# EAGLE design working (EAGLE 9.0.0)
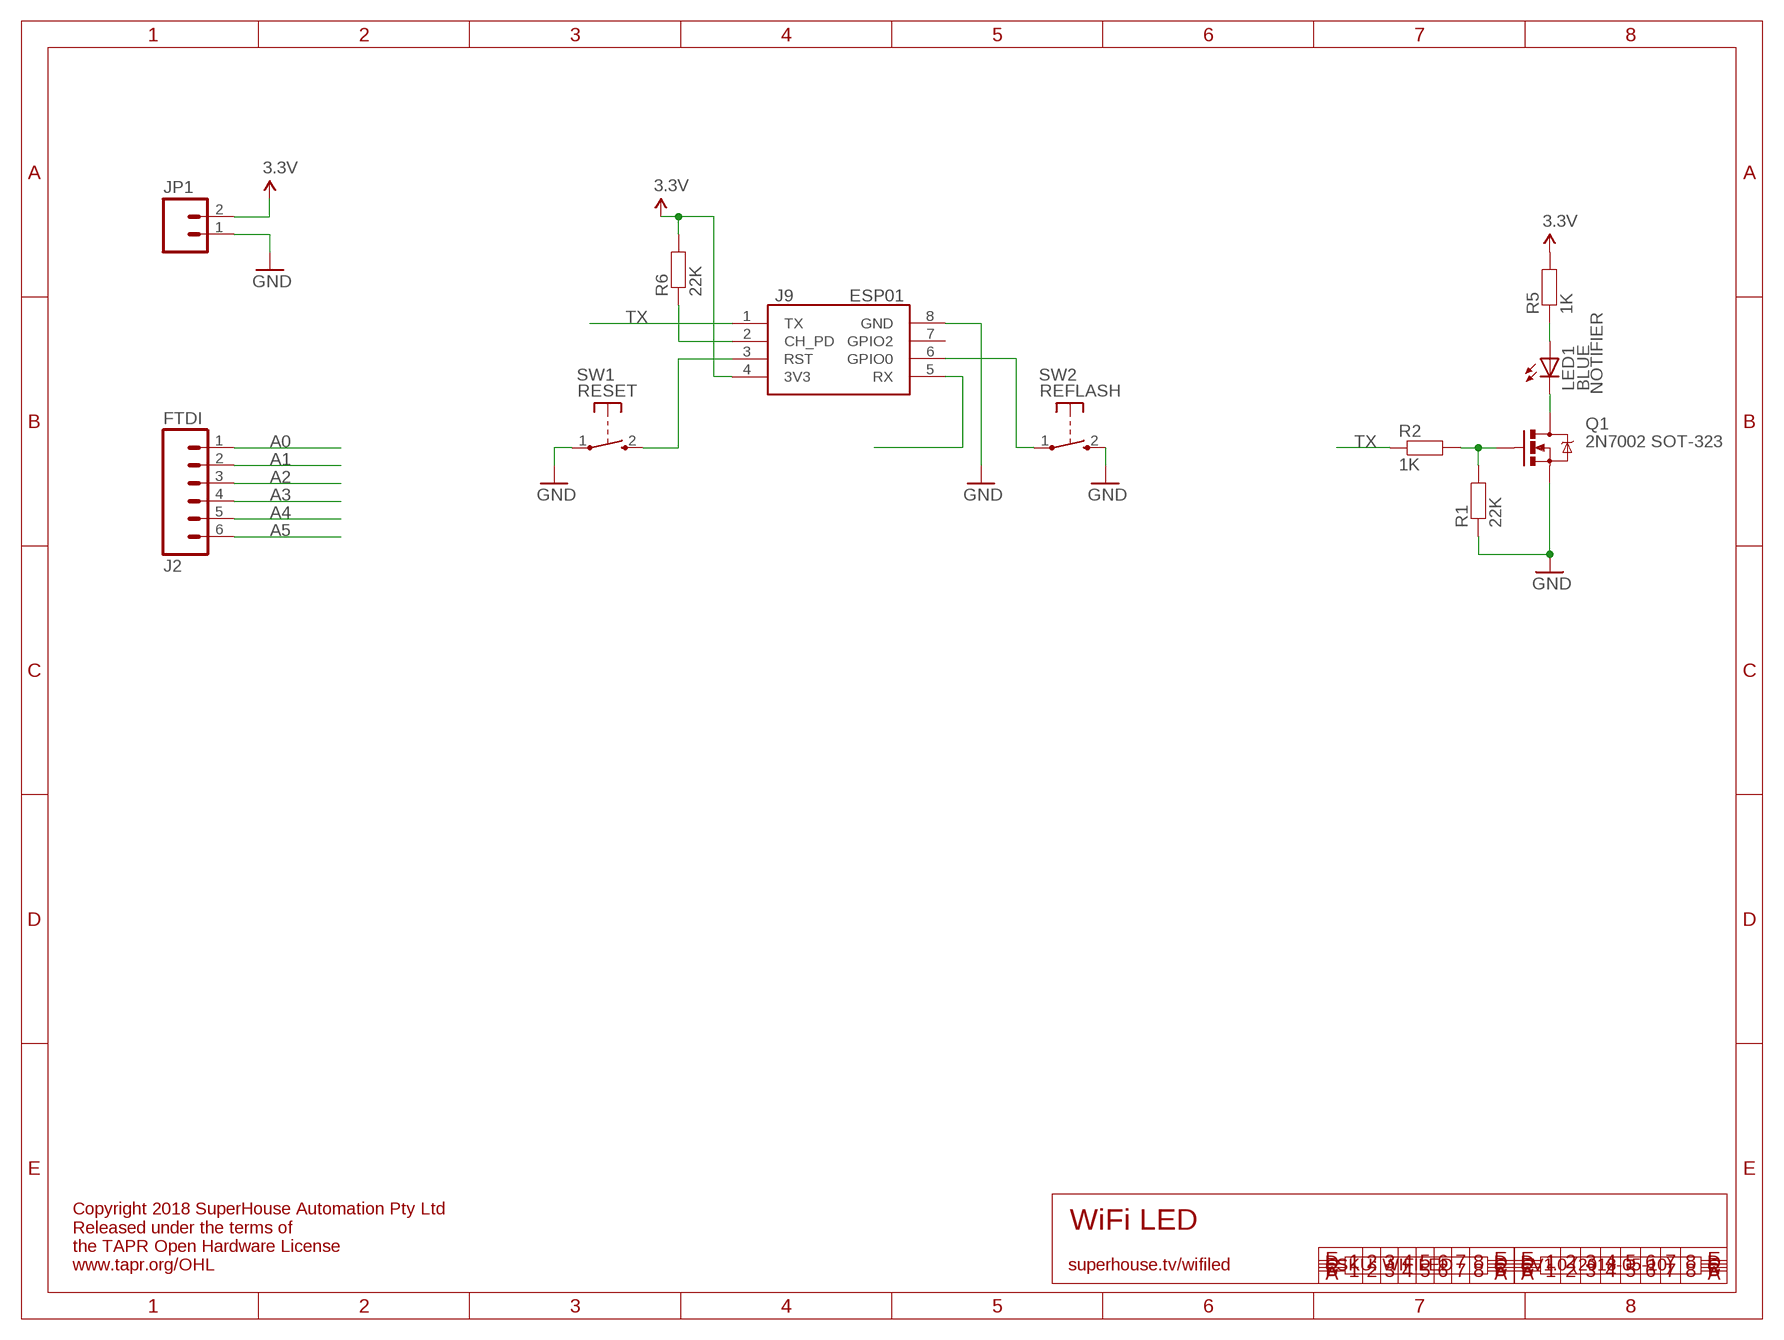
[diagram p0: schematic, sheet 1]

## Parts
J2  FTDI  M06SIP  [1X06]
J9  ESP01  [ESP01]
JP1  M02PTH  [1X02]
LED1  BLUE  LED0603  [LED-0603]
Q1  2N7002 SOT-323  MOSFET-NSOT-323  [SOT32-3]
R1  22K  RESISTOR0603  [0603]
R2  1K  RESISTOR0603  [0603]
R5  1K  RESISTOR0603  [0603]
R6  22K  RESISTOR0603  [0603]
SW1  RESET  TAC_SWITCH_2PIN  [TACTILE_SWITCH_SMD_2PIN_TINY]
SW2  REFLASH  TAC_SWITCH_2PIN  [TACTILE_SWITCH_SMD_2PIN_TINY]

## Nets
3.3V: J9.4(3V3) JP1.2 R5.2 R6.2
A0: J2.1
A1: J2.2
A2: J2.3
A3: J2.4
A4: J2.5
A5: J2.6
GND: J9.8(GND) JP1.1 Q1.2(S) R1.1 SW1.1(P) SW2.2(S)
N$1: J9.6(GPIO0) SW2.1(P)
N$2: LED1.C Q1.3(D)
N$3: J9.3(RST) SW1.2(S)
N$4: J9.2(CH_PD) R6.1
N$14: LED1.A R5.1
N$45: J9.5(RX)
N$58: Q1.1(G) R1.2 R2.2
TX: J9.1(TX) R2.1
Unconnected: J9.7(GPIO2)

## Notes on the sheet
- NOTIFIER
- WiFi LED
- Copyright 2018 SuperHouse Automation Pty Ltd
  Released under the terms of
  the TAPR Open Hardware License
  www.tapr.org/OHL
- superhouse.tv/wifiled | SKU: WIFILED | V1.0 (2018-05-10)

## Library data of the parts
J2 = freetronics:M06: Header 6 Standard 6-pin 0.1" header. Use with straight break away headers (SKU : PRT-00116), right angle break away headers (PRT-00553), swiss pins (PRT-00743), machine pins (PRT-00117), and female headers (PRT-00115). Molex polarized connector foot print use with SKU : PRT-08094 with associated crimp pins and housings. NOTES ON THE VARIANTS LOCK and LOCK_LONGPADS... This footprint was designed to help hold the alignment of a through-hole component (i.e. 6-pin header) while soldering it into place. You may notice that each hole has been shifted either up or down by 0.005 of an inch from it's more standard position (which is a perfectly straight line). This slight alteration caused the pins (the squares in the middle) to touch the edges of the holes. Because they are alternating, it causes a "brace" to hold the component in place. 0.005 has proven to be the perfect amount of "off-center" position when using our standard breakaway headers. Although looks a little odd when you look at the bare footprint, once you have a header in there, the alteration is very hard to notice. Also, if you push a header all the way into place, it is covered up entirely on the bottom side. This idea of altering the position of holes to aid alignment will be further integrated into the Sparkfun Library for other footprints. It can help hold any component with 3 or more connection pins.
J9 = freetronics-jon:ESP01
JP1 = freetronics-jon:M02: Header 2 Standard 2-pin 0.1" header. Use with straight break away headers (SKU : PRT-00116), right angle break away headers (PRT-00553), swiss pins (PRT-00743), machine pins (PRT-00117), and female headers (PRT-00115). Molex polarized connector foot print use with SKU : PRT-08233 with associated crimp pins and housings.
LED1 = freetronics-jon:LED: LEDs Standard schematic elements and footprints for 5mm, 3mm, 1206, and 0603 sized LEDs. 5mm - Spark Fun Electronics SKU : COM-00529 (and others)
Q1 = freetronics-jon:MOSFET-N: Basic N-Channel MOSFET
R1 R2 R5 R6 = freetronics-jon:RESISTOR: Resistor Basic schematic elements and footprints for 0603, 1206, and PTH 1/10th watt (small) resistors.
SW1 SW2 = freetronics-jon:TAC_SWITCH_2PIN: Momentary Tactile Switch - 2 pin

## Board
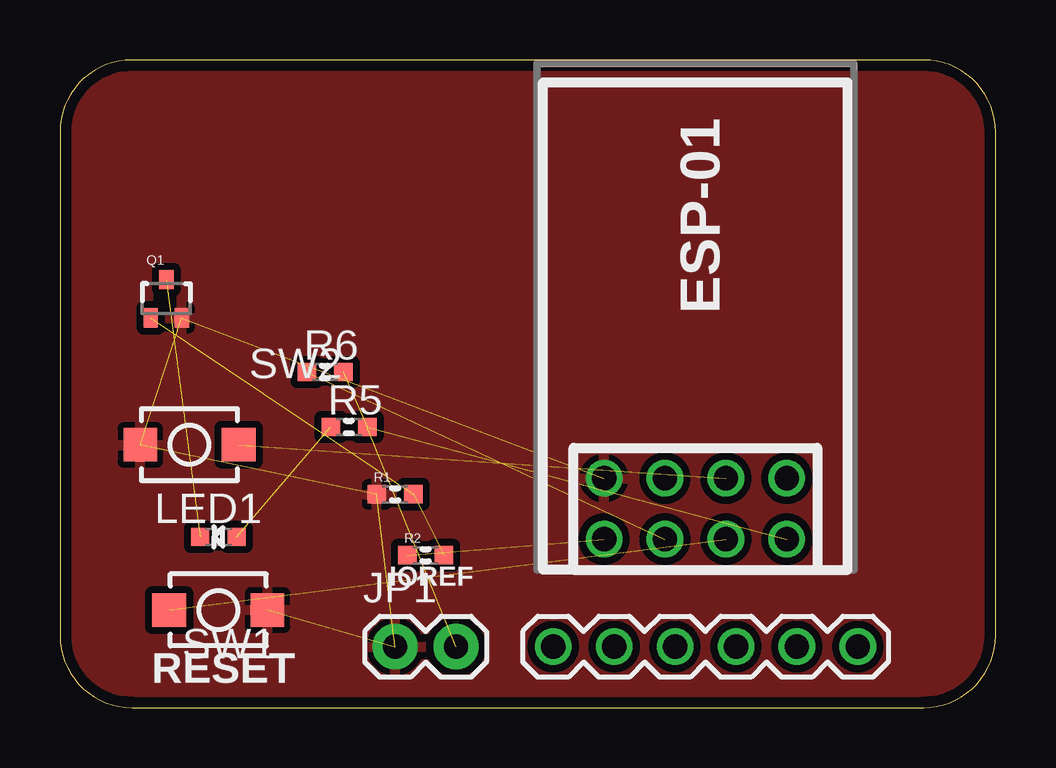
[diagram p1: board, top side]
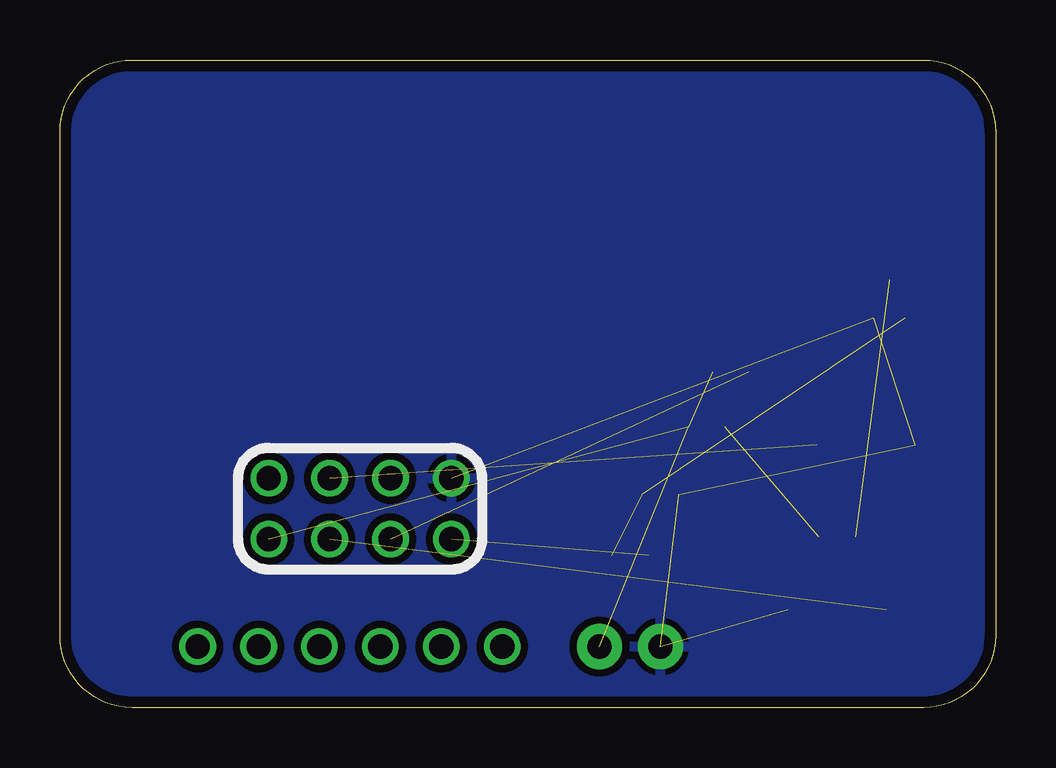
[diagram p2: board, bottom side, seen from below]

Size 39 x 27 mm. Coordinates in mm from the lower left corner, seen from the top.
Outline: 0,3 arc90 3,0 36,0 arc90 39,3 39,24 arc90 36,27 3,27 arc90 0,24 0,3
Copper layers (1*16): Top 0.035mm / dielectric 1.5mm / Bottom 0.035mm
Design rules "default *": minimum track width 10mil, minimum drill 24mil, track to track 12mil, track to pad 12mil, pad to pad 12mil, via to via 12mil, smd to smd 8mil, copper to edge 18mil, drill to drill 8mil, minimum pad ring 10mil, minimum via ring 8mil, stop-mask expansion 4mil, vias tented up to drill 20mil, thermal gap 10mil

### Footprints (pad centres in the part's own frame; a part is rotated, then mirrored left to right if it is on the bottom)
1X06 = drill 1.016: 1 0,0; 2 2.54,0; 3 5.08,0; 4 7.62,0; 5 10.16,0; 6 12.7,0
ESP01 = drill 1.016: 1 -1.27,3.81; 2 -1.27,1.27; 3 -1.27,-1.27; 4 -1.27,-3.81; 5 1.27,-3.81; 6 1.27,-1.27; 7 1.27,1.27; 8 1.27,3.81
1X02 = drill 1.016 pad 1.88: 1 0,0; 2 2.54,0
LED-0603 = smd 0.762 x 0.762: A -0.762,0; C 0.762,0
SOT32-3 = smd 0.6 x 0.8: 1 -0.65,-0.8; 2 0.65,-0.8; 3 0,0.8
0603 = smd 0.762 x 0.762: 1 -0.762,0; 2 0.762,0
TACTILE_SWITCH_SMD_2PIN_TINY = smd 1.4 x 1.4: 1 -2.05,0; 2 2.05,0

### Placement (x,y rotation side)
J2  20.56,2.54 0 top
J9  26.49,8.29 90 top
JP1  13.97,2.54 0 top
LED1  6.6,7.11 180 top
Q1  4.43,17.05 0 top
R1  13.97,8.89 0 top
R2  15.24,6.35 0 top
R5  12.05,11.7 0 top
R6  11.05,13.99 0 top
SW1  6.6,4.06 180 top
SW2  5.4,10.95 180 top

### Tracks (layer width: path | path; a pad name or v marks a point on that pad's centre or on a via)
3.3V  (3 unrouted)
GND  (5 unrouted)
  pour Bottom: 0,24 arc-74 3,27 36,27 arc-74 39,24 39,3 arc-90 36,0 3,0 arc-90 0,3
  pour Top: 0,24 arc-74 3,27 36,27 arc-74 39,24 39,3 arc-90 36,0 3,0 arc-90 0,3
N$1  (1 unrouted)
N$2  (1 unrouted)
N$3  (1 unrouted)
N$4  (1 unrouted)
N$14  (1 unrouted)
N$58  (2 unrouted)
TX  (1 unrouted)

### Text on the board
tPlace: ESP-01 | IOREF | RESET
tNames: SW2 | SW1
tValues: HC-05
tDocu: K | A